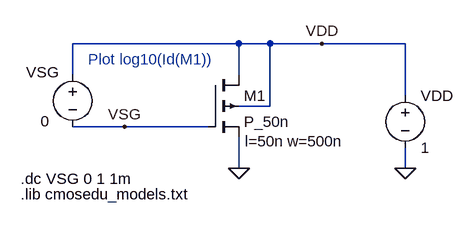
[diagram p0: schematic Fig14_2_PMOS.asc]
Fig14_2_PMOS.asc, the LTspice schematic file:
Version 4
SHEET 1 3172 680
WIRE 192 -256 192 -304
WIRE 272 -176 192 -176
WIRE 400 -176 272 -176
WIRE 448 -304 192 -304
WIRE 448 -256 448 -304
WIRE 448 -112 448 -160
WIRE 496 -304 448 -304
WIRE 496 -208 448 -208
WIRE 496 -208 496 -304
WIRE 576 -304 496 -304
WIRE 704 -304 576 -304
WIRE 704 -224 704 -304
WIRE 704 -112 704 -144
FLAG 704 -112 0
FLAG 576 -304 VDD
FLAG 448 -112 0
FLAG 272 -176 VSG
SYMBOL voltage 704 -240 R0
WINDOW 123 0 0 Left 0
WINDOW 39 0 0 Left 0
SYMATTR InstName VDD
SYMATTR Value 1
SYMBOL voltage 192 -272 R0
WINDOW 3 -49 87 Left 0
WINDOW 123 0 0 Left 0
WINDOW 39 0 0 Left 0
WINDOW 0 -72 12 Left 0
SYMATTR Value 0
SYMATTR InstName VSG
SYMBOL pmos4 400 -256 R0
WINDOW 123 57 102 Left 0
SYMATTR Value2 l=50n w=500n
SYMATTR InstName M1
SYMATTR Value P_50n
TEXT 112 -96 Left 0 !.dc VSG 0 1 1m
TEXT 112 -72 Left 0 !.lib cmosedu_models.txt
TEXT 216 -280 Left 0 ;Plot log10(Id(M1))

The netlist it stands for:
* Fig14_2_PMOS.asc
VDD VDD 0 1
VSG VDD VSG 0
M1 VDD VSG 0 VDD P_50n l=50n w=500n
.model NMOS NMOS
.model PMOS PMOS
.lib standard.mos
.dc VSG 0 1 1m
.lib cmosedu_models.txt
* Plot log10(Id(M1))
.backanno
.end